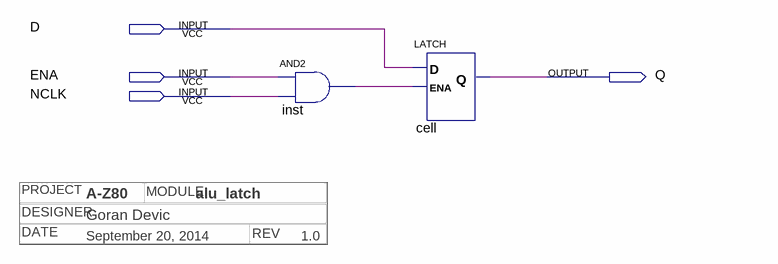
[diagram p0: schematic sheet]
// Quartus schematic alu_latch.bdf as structural Verilog: 2 symbols, 4 pins
// Title block: DATE: September 20, 2014; DESIGNER: Goran Devic; MODULE: alu_latch; PROJECT: A-Z80; REV: 1.0
module alu_latch (
  input  D,
  input  ENA,
  input  NCLK,
  output Q
);

  wire inst_out;

  and inst (inst_out, ENA, NCLK);
  LATCH \cell  (.D(D), .ENA(inst_out), .Q(Q));
endmodule
